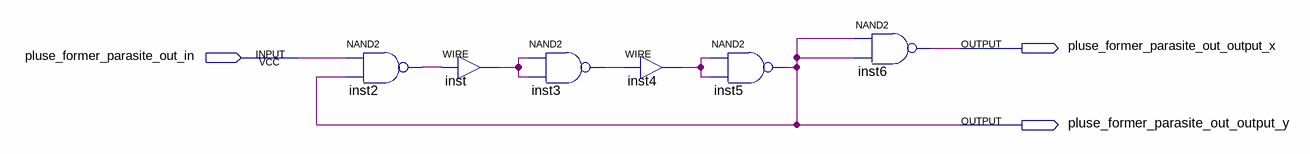
[diagram p0: schematic sheet]
// Quartus schematic pluse_former_parasite_output.bdf as structural Verilog: 6 symbols, 3 pins
module pluse_former_parasite_output (
  input  pluse_former_parasite_out_in,
  output pluse_former_parasite_out_output_x,
  output pluse_former_parasite_out_output_y
);

  wire inst2_out, inst3_out, inst4_out, inst_out;

  nand inst2 (inst2_out, pluse_former_parasite_out_in, pluse_former_parasite_out_output_y);
  assign inst_out = inst2_out;  // WIRE inst
  nand inst3 (inst3_out, inst_out, inst_out);
  assign inst4_out = inst3_out;  // WIRE inst4
  nand inst5 (pluse_former_parasite_out_output_y, inst4_out, inst4_out);
  nand inst6 (pluse_former_parasite_out_output_x, pluse_former_parasite_out_output_y, pluse_former_parasite_out_output_y);
endmodule
